# EAGLE design BlueDaq_V1.0 (EAGLE 7.6.0)
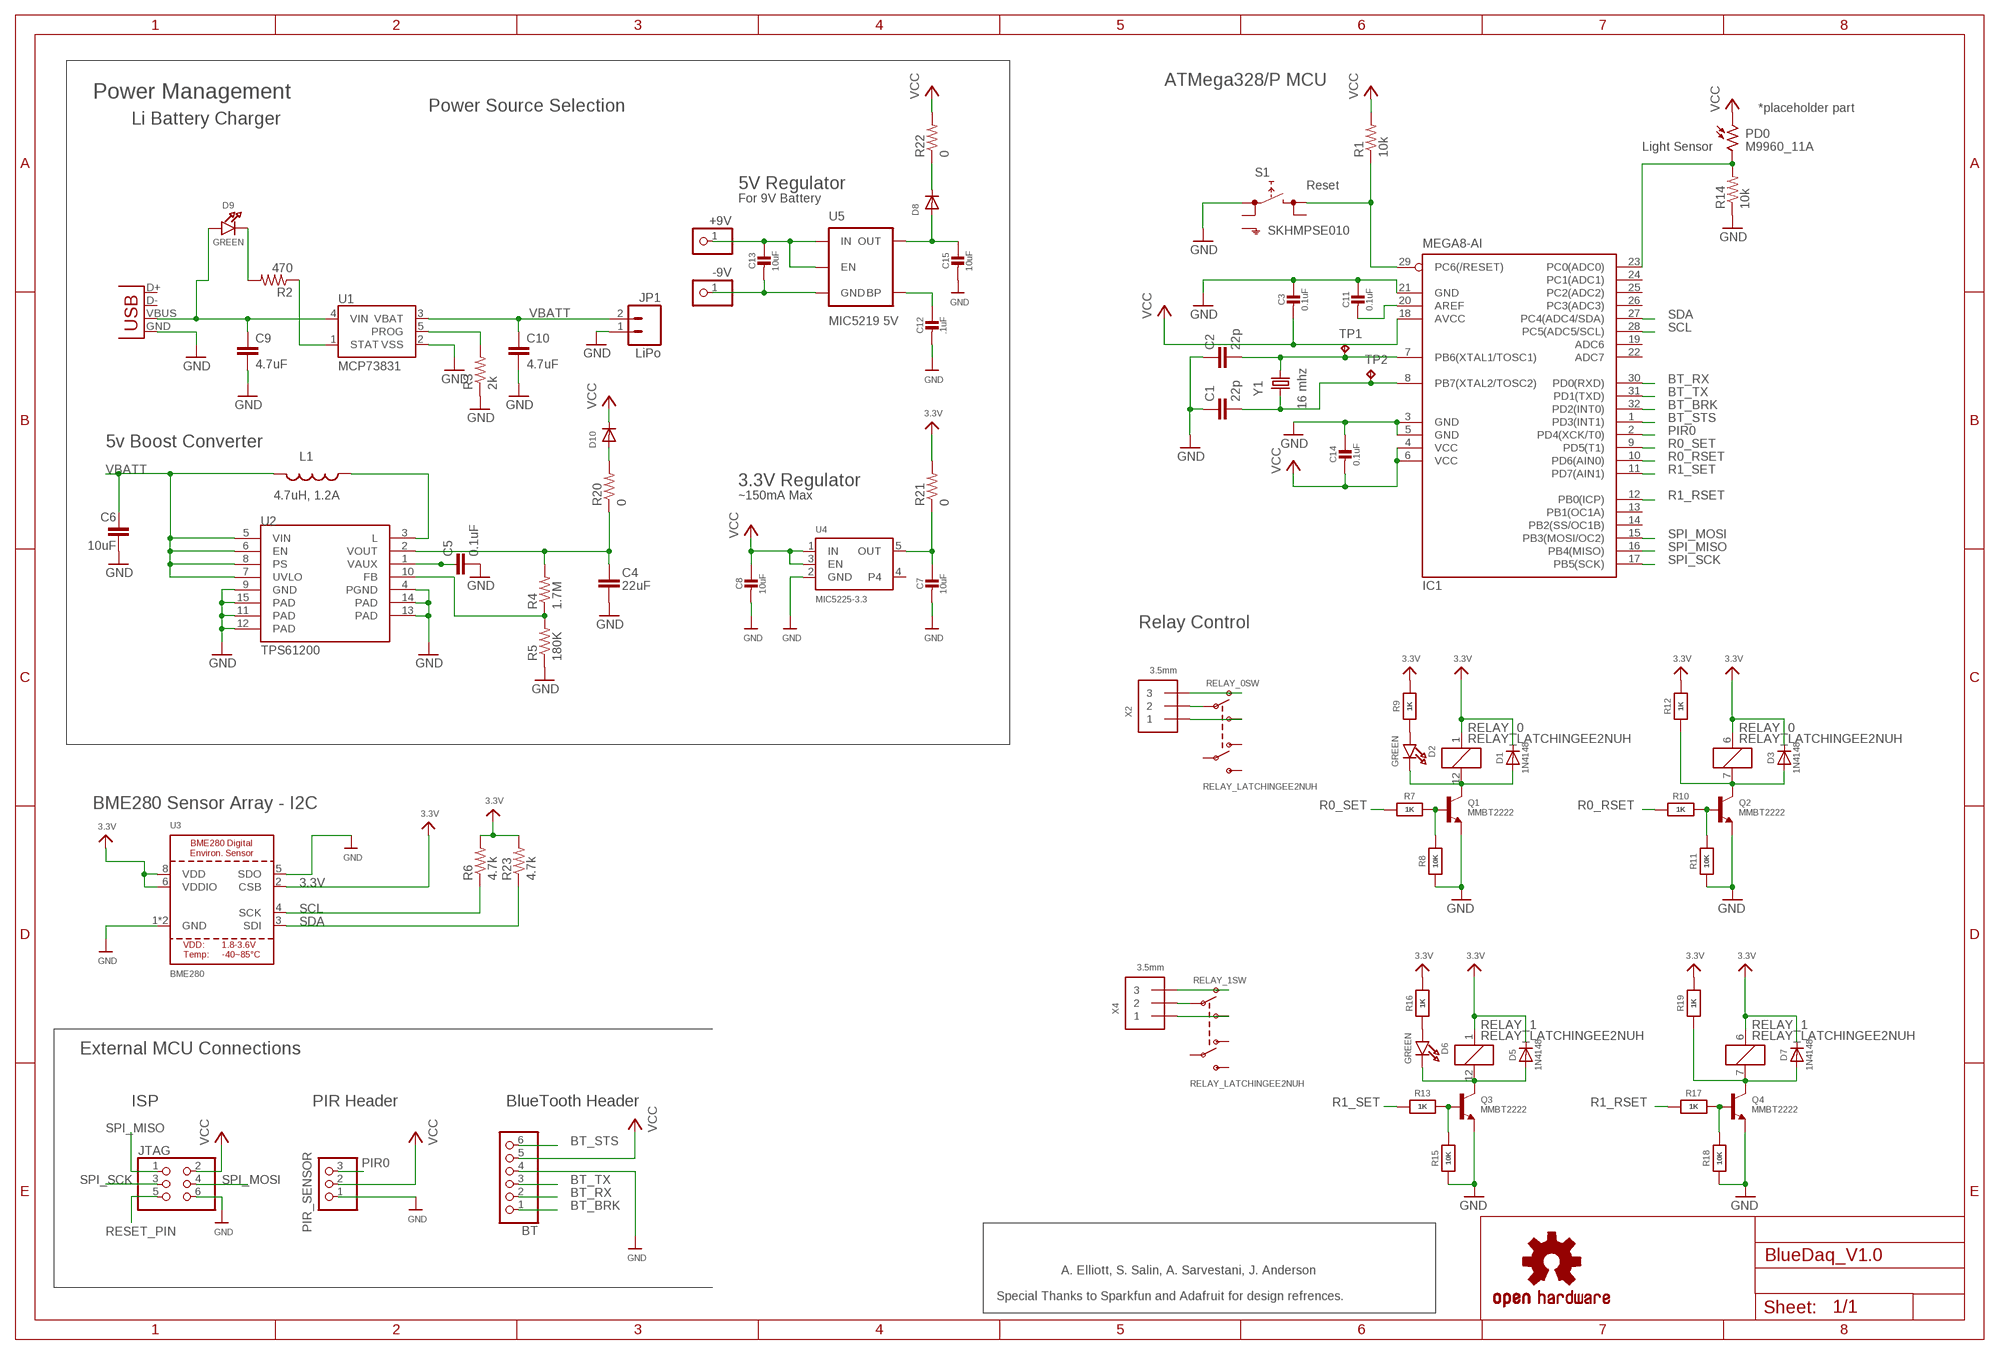
[diagram p0: schematic, sheet 1]

## Parts
+9V  PINHD-1X1  [1X01]
-9V  PINHD-1X1  [1X01]
BT  PINHD-1X6  [1X06]
C1  22p  C-EUC0805  [C0805]
C2  22p  C-EUC0805  [C0805]
C3  0.1uF  CAP_CERAMIC0805-NOOUTLINE  [0805-NO@1]
C4  22uF  CAP0805  [0805]
C5  0.1uF  CAP0805  [0805]
C6  10uF  CAP1206  [1206]
C7  10uF  CAP_CERAMIC0805-NOOUTLINE  [0805-NO@1]
C8  10uF  CAP_CERAMIC0805-NOOUTLINE  [0805-NO@1]
C9  4.7uF  CAP0805  [0805]
C10  4.7uF  CAP0805  [0805]
C11  0.1uF  CAP_CERAMIC0805-NOOUTLINE  [0805-NO@1]
C12  .1uF  CAP_CERAMIC0805-NOOUTLINE  [0805-NO@1]
C13  10uF  CAP_CERAMIC0805-NOOUTLINE  [0805-NO@1]
C14  0.1uF  CAP_CERAMIC0805-NOOUTLINE  [0805-NO@1]
C15  10uF  CAP_CERAMIC0805-NOOUTLINE  [0805-NO@1]
D1  1N4148  DIODESOD-323  [SOD-323]
D2  GREEN  LED0805_NOOUTLINE  [CHIPLED_0805_NOOUTLINE]
D3  1N4148  DIODESOD-323  [SOD-323]
D5  1N4148  DIODESOD-323  [SOD-323]
D6  GREEN  LED0805_NOOUTLINE  [CHIPLED_0805_NOOUTLINE]
D7  1N4148  DIODESOD-323  [SOD-323]
D8  DIODESMA  [SMADIODE]
D9  GREEN  LED0805_NOOUTLINE  [CHIPLED_0805_NOOUTLINE]
D10  DIODESMA  [SMADIODE]
IC1  MEGA8-AI  [TQFP32-08]
JP1  LiPo  M02-JST-2MM-SMT  [JST-2-SMD]
JTAG  PINHD-2X3  [2X03]
L1  4.7uH, 1.2A  INDUCTOR.  [CDRH2D09]
PD0  M9960_11A  [M9960]
PIR_SENSOR  PINHD-1X3  [1X03]
Q1  MMBT2222  TRANSISTOR_NPN  [SOT23-R]
Q2  MMBT2222  TRANSISTOR_NPN  [SOT23-R]
Q3  MMBT2222  TRANSISTOR_NPN  [SOT23-R]
Q4  MMBT2222  TRANSISTOR_NPN  [SOT23-R]
R1  10k  R-US_R0805  [R0805]
R2  470  R-US_R0805  [R0805]
R3  2k  R-US_R0805  [R0805]
R4  1.7M  R-US_R0805  [R0805]
R5  180K  R-US_R0805  [R0805]
R6  4.7k  R-US_R0805  [R0805]
R7  1K  RESISTOR0805_NOOUTLINE  [0805-NO]
R8  10K  RESISTOR0805_NOOUTLINE  [0805-NO]
R9  1K  RESISTOR0805_NOOUTLINE  [0805-NO]
R10  1K  RESISTOR0805_NOOUTLINE  [0805-NO]
R11  10K  RESISTOR0805_NOOUTLINE  [0805-NO]
R12  1K  RESISTOR0805_NOOUTLINE  [0805-NO]
R13  1K  RESISTOR0805_NOOUTLINE  [0805-NO]
R14  10k  R-US_R0805  [R0805]
R15  10K  RESISTOR0805_NOOUTLINE  [0805-NO]
R16  1K  RESISTOR0805_NOOUTLINE  [0805-NO]
R17  1K  RESISTOR0805_NOOUTLINE  [0805-NO]
R18  10K  RESISTOR0805_NOOUTLINE  [0805-NO]
R19  1K  RESISTOR0805_NOOUTLINE  [0805-NO]
R20  0  R-US_R0805  [R0805]
R21  0  R-US_R0805  [R0805]
R22  0  R-US_R0805  [R0805]
R23  4.7k  R-US_R0805  [R0805]
RELAY_0  RELAY_LATCHINGEE2NUH  [RELAY_EE2_LATCH]
RELAY_1  RELAY_LATCHINGEE2NUH  [RELAY_EE2_LATCH]
S1  SKHMPSE010  [SKHMPXE010]
TP1  TPTP19SQ  [TP19SQ]
TP2  TPTP19SQ  [TP19SQ]
U1  MCP73831  [SOT23-5]
U2  TPS61200  [QFN-10_PAD]
U3  BME280  [BME280]
U4  MIC5225-3.3  VREG_SOT23-5  [SOT23-5]
U5  MIC5219 5V  V_REG_MIC52195V  [SOT23-5]
U$22  OSHW-LOGOS  [OSHW-LOGO-S]
X1  USB-MICROB  [USB-MICROB]
X2  3.5mm  TERMBLOCK_1X3  [TERMBLOCK_1X3-3.5MM]
X4  3.5mm  TERMBLOCK_1X3  [TERMBLOCK_1X3-3.5MM]
Y1  16 mhz  CRYSTALHC49UV  [HC49U-V]

## Nets
3.3V: D1.C D3.C D5.C D7.C R6.2 R9.2 R12.2 R16.2 R19.2 R21.2 R23.2 RELAY_0.1 RELAY_0.6 RELAY_1.1 RELAY_1.6 U3.2(CSB) U3.6(VDDIO) U3.8(VDD)
BT_BRK: BT.1 IC1.32(PD2(INT0))
BT_RX: BT.2 IC1.30(PD0(RXD))
BT_STS: BT.6 IC1.1(PD3(INT1))
BT_TX: BT.3 IC1.31(PD1(TXD))
COM1 [HV]: RELAY_0.9(SW:P1) X2.2
COM2 [HV]: RELAY_1.9(SW:P1) X4.2
FB: R4.1 R5.2 U2.10(FB)
GND: BT.4 C1.1 C2.1 C3.1 C4.2 C5.2 C6.2 C7.2 C8.2 C9.2 C10.2 C11.1 C12.2 C14.1 C15.2 IC1.3(GND) IC1.5(GND) IC1.21(GND) JP1.1 JTAG.6 PIR_SENSOR.1 Q1.2(E) Q2.2(E) Q3.2(E) Q4.2(E) R3.1 R5.1 R8.1 R11.1 R14.1 R15.1 R18.1 S1.1(1.1) U1.2(VSS) U2.4(PGND) U2.9(GND) U2.11(PAD) U2.12(PAD) U2.13(PAD) U2.14(PAD) U2.15(PAD) U3.1(GND) U3.5(SDO) U3.7(GND) U4.2(GND) X1.GND
N$1: IC1.23(PC0(ADC0)) PD0.2 R14.2
N$2: L1.P$1 U2.3(L)
N$3: C5.1 U2.1(VAUX)
N$4: D9.C R2.2
N$5: C15.1 D8.A U5.5(OUT)
N$6: D1.A D2.C Q1.3(C) RELAY_0.12
N$7: D5.A D6.C Q3.3(C) RELAY_1.12
N$8: Q3.1(B) R13.2 R15.2
N$9: D6.A R16.1
N$10 [HV]: RELAY_1.10(SW:O1) X4.3
N$11: R3.2 U1.5(PROG)
N$12: D7.A Q4.3(C) R19.1 RELAY_1.7
N$13: Q4.1(B) R17.2 R18.2
N$14: R2.1 U1.1(STAT)
N$15: +9V.1 C13.1 U5.1(IN) U5.3(EN)
N$16: -9V.1 C13.2 U5.2(GND)
N$17: C12.1 U5.4(BP)
N$18: D8.C R22.1
N$20: D10.A R20.2
N$22: Q1.1(B) R7.2 R8.2
N$23: C9.1 D9.A U1.4(VIN) X1.VBUS
N$25: D3.A Q2.3(C) R12.1 RELAY_0.7
N$26: D2.A R9.1
N$27: Q2.1(B) R10.2 R11.2
N$28 [HV]: RELAY_0.10(SW:O1) X2.3
N$36: C11.2 IC1.20(AREF)
NO1 [HV]: RELAY_0.8(SW:S1) X2.1
NO2 [HV]: RELAY_1.8(SW:S1) X4.1
OUT: C7.1 R21.1 U4.5(OUT)
PIR0: IC1.2(PD4(XCK/T0)) PIR_SENSOR.3
R0_RSET: IC1.10(PD6(AIN0)) R10.1
R0_SET: IC1.9(PD5(T1)) R7.1
R1_RSET: IC1.12(PB0(ICP)) R17.1
R1_SET: IC1.11(PD7(AIN1)) R13.1
RESET_PIN: IC1.29(PC6(/RESET)) JTAG.5 R1.1 S1.3(2.1)
SCL: IC1.28(PC5(ADC5/SCL)) R6.1 U3.4(SCK)
SDA: IC1.27(PC4(ADC4/SDA)) R23.1 U3.3(SDI)
SPI_MISO: IC1.16(PB4(MISO)) JTAG.1
SPI_MOSI: IC1.15(PB3(MOSI/OC2)) JTAG.4
SPI_SCK: IC1.17(PB5(SCK)) JTAG.3
VBATT: C6.1 C10.1 JP1.2 L1.P$2 U1.3(VBAT) U2.5(VIN) U2.6(EN) U2.7(UVLO) U2.8(PS)
VCC: BT.5 C3.2 C8.1 C14.2 D10.C IC1.4(VCC) IC1.6(VCC) IC1.18(AVCC) JTAG.2 PD0.1 PIR_SENSOR.2 R1.2 R22.2 U4.1(IN) U4.3(EN)
VOUT: C4.1 R4.2 R20.1 U2.2(VOUT)
XTAL1: C2.2 IC1.7(PB6(XTAL1/TOSC1)) TP1.TP Y1.2
XTAL2: C1.2 IC1.8(PB7(XTAL2/TOSC2)) TP2.TP Y1.1
Unconnected: IC1.13(PB1(OC1A)) IC1.14(PB2(SS/OC1B)) IC1.19(ADC6) IC1.22(ADC7) IC1.24(PC1(ADC1)) IC1.25(PC2(ADC2)) IC1.26(PC3(ADC3)) RELAY_0.3(SW:O2) RELAY_0.4(SW:P2) RELAY_0.5(SW:S2) RELAY_1.3(SW:O2) RELAY_1.4(SW:P2) RELAY_1.5(SW:S2) S1.2(1.2) S1.4(2.2) S1.5(SH) U4.4 X1.D+ X1.D-

## Notes on the sheet
- ATMega328/P MCU
- Power Management
- Power Source Selection | *placeholder part
- Li Battery Charger
- Light Sensor
- 5V Regulator | Reset
- For 9V Battery
- 5v Boost Converter
- 3.3V Regulator
- ~150mA Max
- Relay Control
- BME280 Sensor Array - I2C
- External MCU Connections
- ISP | PIR Header | BlueTooth Header
- A. Elliott, S. Salin, A. Sarvestani, J. Anderson
- Special Thanks to Sparkfun and Adafruit for design refrences.
- Z:/Documents/School/ECE 411 & Capstone/BlueDaq Logo.bmp

## Library data of the parts
+9V -9V = adafruit:PINHD-1X1: Pin header 1x1 for 0.1" spacing With round pins
BT = adafruit:PINHD-1X6: PIN HEADER
C1 C2 = rcl:C-EU: CAPACITOR, European symbol
C3 C7 C8 C11-C15 = microbuilder:CAP_CERAMIC: Ceramic Capacitors For new designs, use the packages preceded by an '_' character since they are more reliable: The following footprints should be used on most boards: _0402 - Standard footprint for regular board layouts _0603 - Standard footprint for regular board layouts _0805 - Standard footprint for regular board layouts _1206 - Standard footprint for regular board layouts For extremely tight-pitch boards where space is at a premium, the following 'micro-pitch' footprints can be used (smaller pads, no silkscreen outline, etc.): _0402MP - Micro-pitch footprint for very dense/compact boards _0603MP - Micro-pitch footprint for very dense/compact boards _0805MP - Micro-pitch footprint for very dense/compact boards _1206MP - Micro-pitch footprint for very dense/compact boards
C4 C6 = CH_passive:CAP: Capacitor Standard 0603 ceramic capacitor, and 0.1" leaded capacitor.
C5 C9 C10 = SparkFun:CAP: Capacitor Standard 0603 ceramic capacitor, and 0.1" leaded capacitor.
D1 D3 D5 D7 = microbuilder:DIODE: Diode
D2 D6 D9 = microbuilder:LED: LED 0603 - 0603 Surface Mount Package 2mA: Green LED - Low Power (3.9mcd, 2ma, 1.7Vf) - Digikey: 475-2709-2-ND Orange LED - Low Power (9.8mcd, 2ma, 1.8Vf) - Digikey: 475-1194-2-ND Red LED - Low Power (5mcd, 2ma, 1.8Vf) - Digikey: 475-1195-2-ND Yellow LED - Low Power (7mcd, 2ma, 1.8Vf) - Digikey: 475-1196-2-ND 5mA: Blue LED - Low Power (17mcd, 5ma, 2.9Vf) - Digikey: LNJ937W8CRACT-ND 0805 - 0805 Surface Mount Package 2mA: Red LED (8.8mcd, 2mA, 1.8Vf, Clear) - Low Power [Digikey: 475-2510-1-ND] Green LED (5mcd, 2mA, 1.8Vf, Clear) - Low Power [Digikey: 475-2730-1-ND] Yellow LED (11.3mcd, 2mA, 1.8Vf, Clear) - Low Power [Digikey: 475-2555-1-ND] 20mA: Red LED (104mcd, 20mA, Diffused) - LS R976 [Digikey: 475-1278-6-ND] Red LED (12mcd, 20mA, 2.0Vf, Clear) - APT2012EC [Digikey: 754-1128-1-ND] Green LED (15mcd, 20mA, 2.2Vf, Clear) - APT2012GC [Digikey: 754-1131-1-ND] Orange LED (160mcd, 20mA, 2.1Vf, Clear) - APT2012SECK [Digikey: 754-1130-1-ND] 1206 - 1206 Surface Mount Package Green LED (26mcd, 20mA, Diffused) - LG N971 [Digikey: 475-1407-6-ND] Red LED (15mcd, 20mA, Diffused) - LH N974 [Digikey: 475-1416-6-ND] Cree - Cree High-Power Surface Mount LEDs XPEBWT-L1-0000-00D50 - White 111lm 350mA 2.9Vf 6200K 110° XTEAWT-00-0000-00000LEE3 - White 114lm 350mA 2.85Vf 5000K 115° Everlight - Everlight 45-21 Series Surface Mount LEDs 45-21/QK2C-B2832AC2CB2/2T - Warm White 2000mcd 20mA 3.25Vf 3050K 120° 45-21/LK2C-B38452C4CB2/2T - Nuetral White 2000mcd 20mA 3.25Vf 4150K 120° 45-21/LK2C-B50634C6CB2/2T - Cold White 2200mcd 20mA 3.25Vf 5650K 120° PLCC2 Reverse Mount LS T77K-J1L2-1-0-2-R18-Z - Red 11.25mcd 2mA 1.8Vf 630nm 120° LO T77K-L1M2-24-Z - Orange 19.6mcd 2mA 1.8Vf 606nm 120° LY T77K-K2M1-26-Z - Yellow 15.7mcd 2mA 1.8Vf 587nm 120°
D8 D10 = adafruit:DIODE: Diode
IC1 = atmel:MEGA8: MICROCONTROLLER 8 Kbytes FLASH, 1 kbytes SRAM, 512 bytes EEPROM, USART, 6-channel 10 bit ADC, 2-channel 8 bit ADC Pin compatible with Atmega48, ATMega88, ATMega168 Source: avr.lbr; MPN: ATMEGA8-16AU; OC_FARNELL: 9171371; OC_NEWARK: 73M8863
JP1 = SparkFun:M02: Header 2 Standard 2-pin 0.1" header. Use with straight break away headers (SKU : PRT-00116), right angle break away headers (PRT-00553), swiss pins (PRT-00743), machine pins (PRT-00117), and female headers (PRT-00115). Molex polarized connector foot print use with SKU : PRT-08233 with associated crimp pins and housings.
JTAG = pinhead:PINHD-2X3: PIN HEADER
L1 = SparkFun:INDUCTOR: Inductors Basic Inductor/Choke - 0603 and 1206. Footprints are not proven and vary greatly between part numbers.
PD0 = photo-elements:M9960_11: Photo Sensor Beacon Light, Photometer Applications Source: http://optoelectronics.perkinelmer.com/content/Datasheets/DTS_M9960.pdf
PIR_SENSOR = pinhead:PINHD-1X3: PIN HEADER
Q1-Q4 = microbuilder:TRANSISTOR_NPN: NPN Transistor Transistor (NPN) 500mA 45V - BC817 [Digikey: 568-1631-1-ND] Transistor (NPN) 500mA 45V - BC817,215 [Mouser: 771-BC817-T/R] SOT23-R - SOT23 footprint optimised for use with solder paste and reflow ovens. SOT23-W - SOT23 footprint optimised for hand-soldering (larger pads).
R1-R6 R14 R20-R23 = adafruit:R-US_: RESISTOR, American symbol
R7-R13 R15-R19 = microbuilder:RESISTOR: Resistors For new designs, use the packages preceded by an '_' character since they are more reliable: The following footprints should be used on most boards: _0402 - Standard footprint for regular board layouts _0603 - Standard footprint for regular board layouts _0805 - Standard footprint for regular board layouts _1206 - Standard footprint for regular board layouts For extremely tight-pitch boards where space is at a premium, the following 'micro-pitch' footprints can be used (smaller pads, no silkscreen outline, etc.): _0402MP - Micro-pitch footprint for very dense/compact boards _0603MP - Micro-pitch footprint for very dense/compact boards _0805MP - Micro-pitch footprint for very dense/compact boards _1206MP - Micro-pitch footprint for very dense/compact boards
RELAY_0 RELAY_1 = microbuilder:RELAY_LATCHING
S1 = switch:SKHMP*E010: 6.2 X 6.5mm TACT Switch (SMD) Source: http://www3.alps.co.jp/WebObjects/catalog.woa/PDF/E/Switch/Tact/SKHM/SKHM.PDF
TP1 TP2 = testpad:TP: Test pad
U1 = SparkFun:MCP73831: Microchip's MCP73831 Miniature single cell, fully integrated Li-Ion, Li-polymer charge management controller http://ww1.microchip.com/downloads/en/DeviceDoc/21984a.pdf
U2 = SparkFun:TPS61200: DC to DC Booster
U3 = microbuilder:BME280: BME280 - Environmental Sensor (I2C + SPI)
U4 = microbuilder:VREG_SOT23-5: SOT23-5 Fixed Voltage Regulators Part Current Out V Out V In V Dropout θJA (°C/W) TJ (°C) Digikey Part No. ADP121 150mA 3.3V 3.4-5.5V 0.09V @ 150mA -- -- ADP121-AUJZ33R7CT-ND ADP121 150mA 3.0V 3.1-5.5V 0.09V @ 150mA -- -- ADP121-AUJZ30R7CT-ND ADP122 300mA 3.3V 3.4-5.5V 0.085V @ 300mA -- -- ADP122AUJZ-3.3-R7CT-ND ADP1712 300mA 3.3V 3.5-5.5V 0.17V @ 300mA -- -- ADP1712AUJZ-3.3-R7TR-ND AP7311 (Low Cost) 150mA 3.3V 3.5-6V 0.15V @ 150mA -- -- AP7311-33WG-7DICT-ND LD39015M18R 150mA 1.8V 1.9V-5.5V 0.08V @ 100mA -- -- 497-6977-1-ND LP2985A-33DBVR 150mA 3.3V 3.3-16V 0.28V @ 150mA 206 150 296-18479-1-ND MCP1824T-3302E/OT 300mA 3.3V 3.5V-6V 0.2V @ 300mA -- -- MCP1824T-3302E/OTCT-ND MIC5205-2.5YM5 TR 150mA 2.5V 2.7-16V 0.165V @ 150mA -- -- 576-1257-2-ND MIC5205-3.0YM5 TR 150mA 3.0V 3.2V-16V 0.165V @ 150mA -- -- 576-1258-2-ND MIC5205-3.3YM5 TR 150mA 3.3V 3.5V-16V 0.165V @ 150mA -- -- 576-1259-2-ND TPS780330220 150mA 3.3V+2.2V 3.6-5.5V 250mV Max -- -- 296-23332-1-ND TDA3663/N1,135 100mA 3.3V 3.5-45V 0.18V @ 50mA -- -- 568-5343-1-ND Max operating temp can be calculated using θJA, TJ (max junction temperature), and power in watts. Set the "Maximum Ambient Temperature" until it reaches TJ ("Max Junction Temperature"), which is the absolute limit for safe use of the regulator: Heat Sink Temperature Calculator <http://www.daycounter.com/Calculators/Heat-Sink-Temperature-Calculator.phtml> For example, With 12V source into a 3.3V LP2985 and a 30mA load, we are dissipating (12V-3.3V) * 0.03A = 0.261W. With a θJA of 206 °C/W, a TJ of 150°C, and 261mW we can safely use the chip without a heat sink up to 75°C (=147.1°C Junction Temperature).
U5 = SparkFun-PowerIC:V_REG_MIC5219: V_REG MIC5219 Standard 3.3V and 5V 500mA LDO voltage regulator in SOT-23 layout. Micrel part MIC5219. BP (by-pass) pin is used to lower output noise with 470pF cap, may be left open.; PROD_ID: VREG-10107
U$22 = SparkFun:OSHW-LOGO: Open Source Hardware Logo This logo indicates the piece of hardware it is found on incorporates a OSHW license and/or adheres to the definition of open source hardware found here: http://freedomdefined.org/OSHW
X1 = SparkFun:USB: USB Connectors USB-B-PTH is fully proven SKU : PRT-00139 USB-miniB is fully proven SKU : PRT-00587 USB-A-PCB is untested. USB-A-H is throughly reviewed, but untested. Spark Fun Electronics SKU : PRT-00437 USB-B-SMT is throughly reviewed, but untested. Needs silkscreen touching up. USB-A-S has not been used/tested USB-MB-H has not been used/tested
X2 X4 = microbuilder:TERMBLOCK_1X3: 3.5mm Terminal block http://www.ladyada.net/library/pcb/eaglelibrary.html
Y1 = SparkFun-FreqCtrl:CRYSTAL: Various standard crystals. Proven footprints.

## Net classes
1 HV: width 0.406 mm, drill 0.381 mm, clearance 1.016 mm

## Board
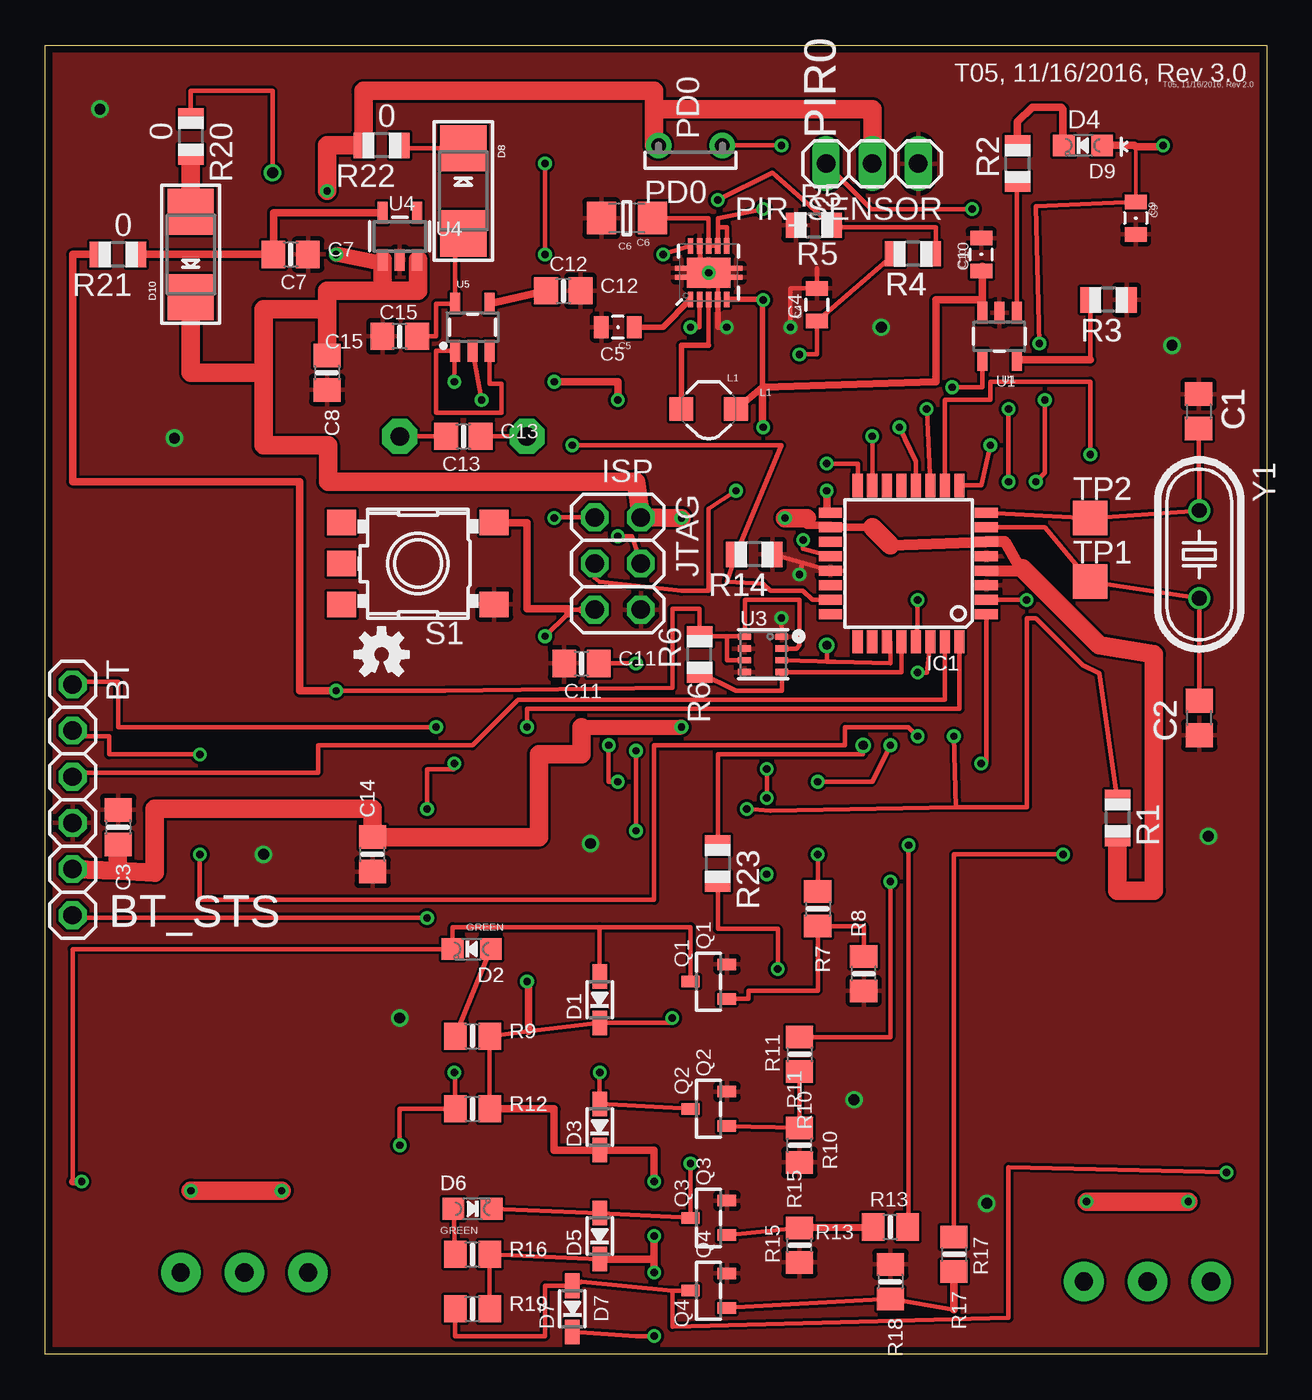
[diagram p1: board, top side]
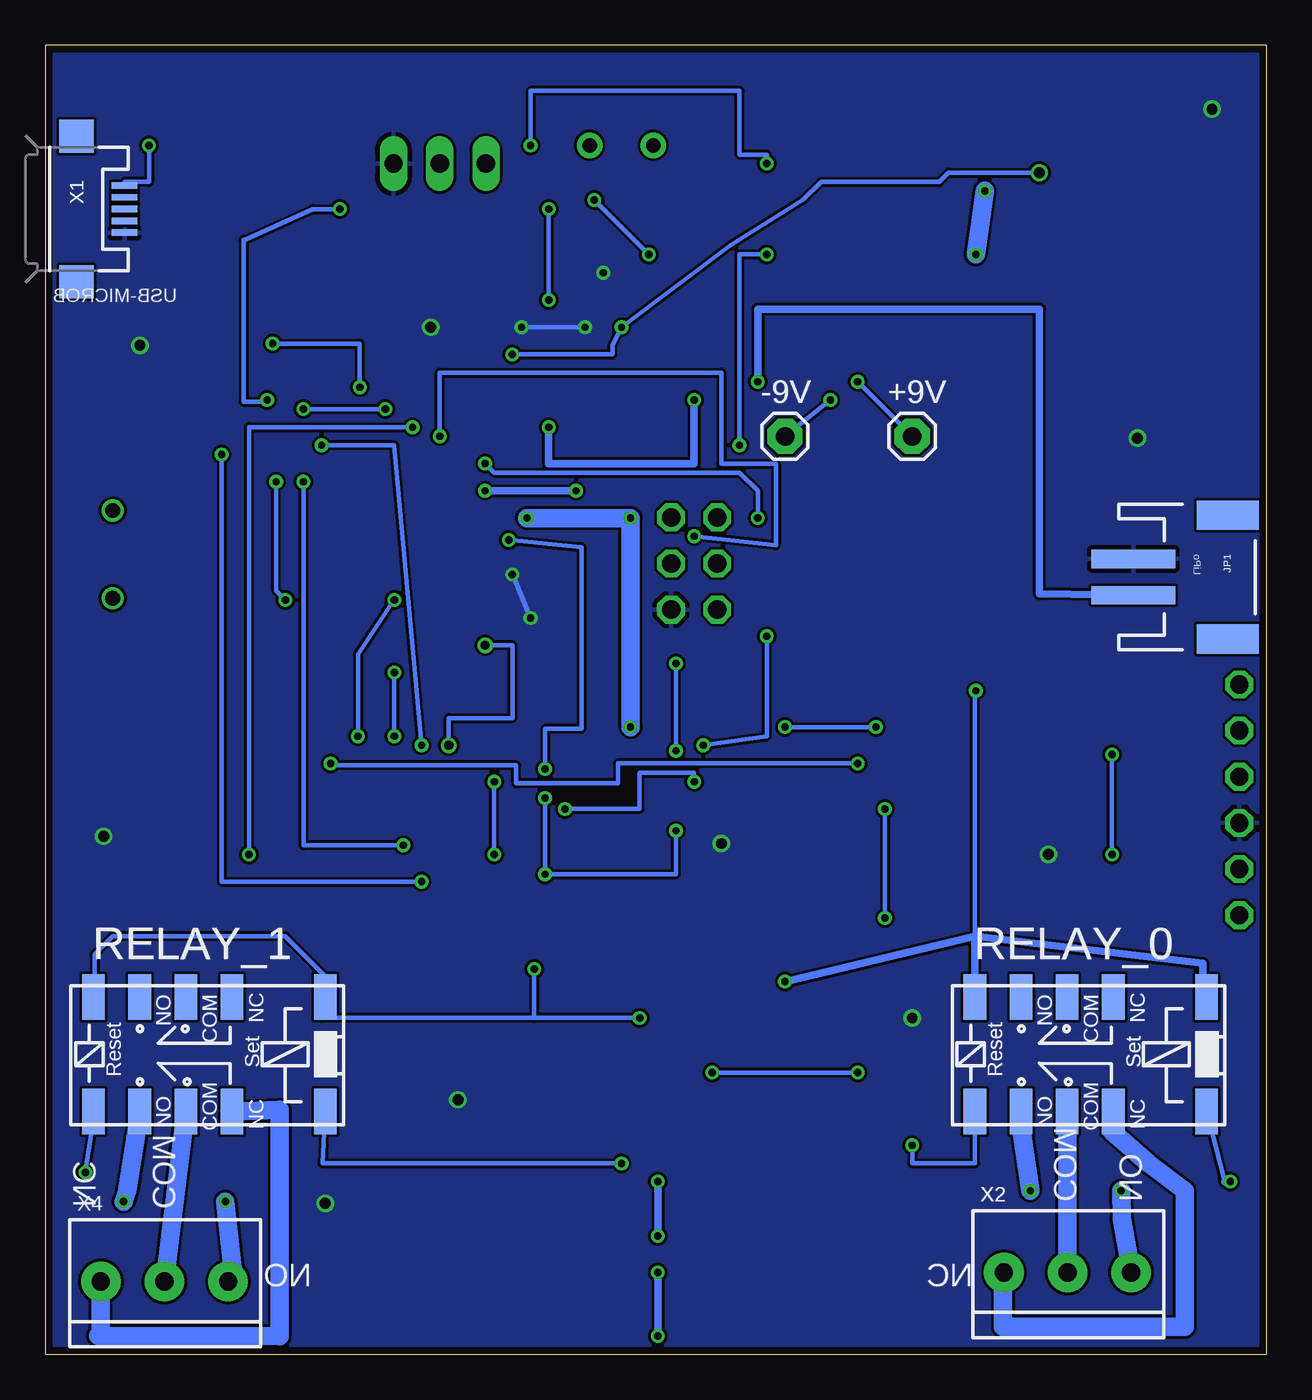
[diagram p2: board, bottom side, seen from below]

Size 67.2 x 72 mm. Coordinates in mm from the lower left corner, seen from the top.
Outline: 0,0 0,72 67.2,72 67.2,0 0,0
Copper layers (1*16): Top 0.0356mm / dielectric 1.5011mm / Bottom 0.0356mm
Design rules "OSH-Park-2-layer": minimum track width 6mil, minimum drill 13mil, track to track 6mil, track to pad 6mil, pad to pad 6mil, via to via 6mil, smd to smd 6mil, copper to edge 15mil, drill to drill 6mil, minimum pad ring 7mil, minimum via ring 7mil, stop-mask expansion 3mil, vias tented up to drill 0mil, thermal gap 10mil

### Footprints (pad centres in the part's own frame; a part is rotated, then mirrored left to right if it is on the bottom)
1X01 = drill 1.016 pad 1.93 octagon: 1 0,0
1X06 = drill 1.016 octagon: 1 -6.35,0; 2 -3.81,0; 3 -1.27,0; 4 1.27,0; 5 3.81,0; 6 6.35,0
C0805 = smd 1.3 x 1.5: 1 -0.95,0; 2 0.95,0
0805-NO@1 = smd 1.3 x 1.5: 1 -0.95,0; 2 0.95,0
0805 = smd 0.8 x 1.2: 1 -0.9,0; 2 0.9,0
1206 = smd 1.6 x 1.8: 1 -1.4,0; 2 1.4,0
SOD-323 = smd 1.35 x 0.8: A 1.27,0; C -1.27,0
CHIPLED_0805_NOOUTLINE = smd 1.2 x 1.2: A 0,-1.05; C 0,1.05
SMADIODE = smd 2.54 x 2.54: A 2.349,0; C -2.349,0
TQFP32-08 = smd 1.27 x 0.559: 1 -4.293,2.8; 2 -4.293,2; 3 -4.293,1.2; 4 -4.293,0.4; 5 -4.293,-0.4; 6 -4.293,-1.2; 7 -4.293,-2; 8 -4.293,-2.8; 17 4.293,-2.8; 18 4.293,-2; 19 4.293,-1.2; 20 4.293,-0.4; 21 4.293,0.4; 22 4.293,1.2; 23 4.293,2; 24 4.293,2.8 | smd 0.559 x 1.27: 9 -2.8,-4.293; 10 -2,-4.293; 11 -1.2,-4.293; 12 -0.4,-4.293; 13 0.4,-4.293; 14 1.2,-4.293; 15 2,-4.293; 16 2.8,-4.293; 25 2.8,4.293; 26 2,4.293; 27 1.2,4.293; 28 0.4,4.293; 29 -0.4,4.293; 30 -1.2,4.293; 31 -2,4.293; 32 -2.8,4.293
JST-2-SMD = smd 1 x 4.6: 1 -1,-3.7; 2 1,-3.7 | smd 1.6 x 3.4: NC1 -3.4,1.5; NC2 3.4,1.5
2X03 = drill 1.016 octagon: 1 -2.54,-1.27; 2 -2.54,1.27; 3 0,-1.27; 4 0,1.27; 5 2.54,-1.27; 6 2.54,1.27
CDRH2D09 = smd 1.3 x 1.3: P$1 -1.5,0; P$2 1.5,0
M9960 = drill 0.8 pad 1.4: 1 -1.75,0; 2 1.75,0
1X03 = drill 1.016 long: 1 -2.54,0; 2 0,0; 3 2.54,0
SOT23-R = smd 0.635 x 1.016: 1 -0.95,-1; 2 0.95,-1; 3 0,1
R0805 = smd 1.1 x 1.4: 1 -1,0; 2 1,0
0805-NO = smd 1.24 x 1.5: 1 -0.95,0; 2 0.95,0
RELAY_EE2_LATCH = smd 1.25 x 2.5: 1 -6.2,-3.15; 3 -1.07,-3.15; 4 1.47,-3.15; 5 4.01,-3.15; 6 6.55,-3.15; 7 6.55,3.15; 8 4.01,3.15; 9 1.47,3.15; 10 -1.07,3.15; 12 -6.2,3.15
SKHMPXE010 = smd 1.6 x 1.4: 1 -4.2,2.25; 2 4.2,2.25; 3 -4.2,-2.25; 4 4.2,-2.25; 5 4.2,0
TP19SQ = smd 1.9 x 1.9: TP 0,0
SOT23-5 = smd 0.55 x 1.2: 1 -0.95,-1.3; 2 0,-1.3; 3 0.95,-1.3; 4 0.95,1.3; 5 -0.95,1.3
QFN-10_PAD = smd 0.297 x 0.85: 1 -1,-1.475; 2 -0.5,-1.475; 3 0,-1.475; 4 0.5,-1.475; 5 1,-1.475; 6 1,1.475; 7 0.5,1.475; 8 0,1.475; 9 -0.5,1.475; 10 -1,1.475 | smd 0.7 x 0.28: 11 -1.5,0.25; 12 -1.5,-0.25; 13 1.5,0.25; 14 1.5,-0.25 | smd 2.4 x 1.65: 15 0,0
BME280 = smd 0.7 x 0.35: 1 1.025,0.975; 2 1.025,0.325; 3 1.025,-0.325; 4 1.025,-0.975; 5 -1.025,-0.975; 6 -1.025,-0.325; 7 -1.025,0.325; 8 -1.025,0.975
USB-MICROB = smd 0.35 x 1.4: D+ 0,2.65; D- -0.65,2.65; GND 1.3,2.65; ID 0.65,2.65; VBUS -1.3,2.65 | smd 1.8 x 1.9: MT1 -4,0; MT2 4,0
TERMBLOCK_1X3-3.5MM = drill 1 pad 2.184: 1 3.55,0; 2 0.05,0; 3 -3.45,0
HC49U-V = drill 0.813: 1 -2.413,0; 2 2.413,0

### Placement (x,y rotation side)
+9V  19.5,50.5 0 bottom
-9V  26.5,50.5 0 bottom
BT  1.5,30.5 270 top
C1  63.46,51.87 270 top
C2  63.5,35 90 top
C3  4,29 270 top
C4  42.46,57.73 90 top
C5  31.5,56.5 180 top
C6  32,62.5 180 top
C7  13.5,60.5 0 top
C8  15.5,54 270 top
C9  60,62.5 270 top
C10  51.5,60.5 90 top
C11  29.5,38 0 top
C12  28.5,58.5 0 top
C13  23,50.5 0 top
C14  18,27.5 90 top
C15  19.5,56 180 top
D1  30.5,19.5 90 top
D2  23.46,22.29 90 top
D3  30.5,12.5 90 top
D5  30.5,6.5 90 top
D6  23.5,8 270 top
D7  29,2.5 90 top
D8  23,64 270 top
D9  57.1,66.5 90 top
D10  8,60.5 90 top
IC1  47.5,43.5 180 top
JP1  3.63,42.75 270 bottom
JTAG  31.5,43.5 270 top
L1  36.5,52 0 top
PD0  35.5,66.5 0 top
PIR_SENSOR  45.5,65.5 180 top
Q1  36.5,20.5 90 top
Q2  36.5,13.5 90 top
Q3  36.5,7.5 90 top
Q4  36.5,3.5 90 top
R1  59,29.5 270 top
R2  53.5,65.5 90 top
R3  58.5,58 180 top
R4  47.74,60.54 180 top
R5  42.29,62.11 0 top
R6  36,38.5 90 top
R7  42.5,24.5 270 top
R8  45.03,20.94 90 top
R9  23.5,17.5 0 top
R10  41.5,16.5 270 top
R11  41.5,11.5 90 top
R12  23.5,13.5 0 top
R13  46.5,7 180 top
R14  39,44 180 top
R15  41.5,6 90 top
R16  23.5,5.5 0 top
R17  50,5.5 270 top
R18  46.5,4 270 top
R19  23.5,2.5 0 top
R20  8,67 270 top
R21  4,60.5 180 top
R22  18.5,66.5 180 top
R23  37,27 270 top
RELAY_0  9.5,16.5 180 bottom
RELAY_1  58,16.5 180 bottom
S1  20.5,43.5 180 top
TP1  57.5,42.5 0 top
TP2  57.5,46 0 top
U1  52.5,56 180 top
U2  36.5,59.5 0 top
U3  39.5,38.5 0 top
U4  19.5,61.5 0 top
U5  23.5,56.5 0 top
U$22  18.5,38.5 0 top
X1  65.5,63 270 bottom
X2  11,4.5 0 bottom
X4  60.7,4 0 bottom
Y1  63.5,44 270 top

### Tracks (layer width: path | path; a pad name or v marks a point on that pad's centre or on a via)
3.3V  (via drill 0.4)
  Top 0.254: R12.2 R9.2 26.59,17.76 D1.C 34.5,18.23 v34.5,18.5 | D5.C R16.2 R19.2 | v33.5,1 32.5,1 D7.C | v16,36.5 22,36.5 34.5,36.67 34.5,41 36,41 R6.2 37.5,39.5 | 37.5,39.5 38.45,39.5 U3.8 38.5,39.48 38.5,41.5 41.5,41.5 41.5,39 41.33,38.83 U3.2 | U3.6 37.5,38.17 37.5,39.5 | R23.2 37,23.4 40.3,23.4 v40.3,21.2
  Top 0.406: D5.C 33.5,5.23 v33.5,4.5 v33.5,6.5 | v33.5,9.5 33.5,11.23 D3.C 28,11.23 28,13.5 R12.2 | R21.2 1.5,60.5 1.5,48 14,48 14,36.5 v16,36.5 | v26.5,20.5 26.59,20.5 26.59,17.76
  Bottom 0.254: 16.05,23 16.05,36.5 v16,36.5 | v34.5,18.5 40.3,18.5 | 40.3,18.5 52,18.5 52,19.5 51.8,19.5 RELAY_1.1 51.8,20.8 54,23 63.5,23 64.5,22 64.5,19.7 RELAY_1.6 | 3.5,19.85 RELAY_0.1 | v40.3,21.2 40.3,18.5
  Bottom 0.406: RELAY_0.6 16.05,23 | 16.05,23 3.5,21.5 3.5,19.85 | v26.5,20.5 16.05,23 | v33.5,4.5 v33.5,1 | v33.5,9.5 v33.5,6.5
BT_BRK  (via drill 0.4)
  Top 0.254: IC1.32 50.3,35.5 26.5,35.5 v26.5,34.5 | v21.5,34.5 4,34.5 4,37 1.5,37 BT.1
  Bottom 0.254: v26.5,34.5 v21.5,34.5
BT_RX  (via drill 0.4)
  Top 0.254: IC1.30 48.5,37.5 v48,37.5 | v8.5,27.5 8.5,25 33.5,25 33.5,33.5 44,33.5 44,34.5 47.5,34.5 v48,34 | v8.5,33 3.5,33 3.5,34 1.5,34 BT.2
  Bottom 0.254: v48,37.5 v48,34 | v8.5,27.5 v8.5,33
BT_STS  (via drill 0.4)
  Top 0.254: IC1.1 51.79,32.5 v51.5,32.5 | v22.5,32.5 22.5,32.18 21,32.18 v21,30 | v21,24 1.5,24
  Top 0.406: 1.5,24 BT.6
  Bottom 0.254: v21,30 v21,24 | v22.5,32.5 35.7,32.5 35.7,31.4 41.3,31.4 41.3,32.4 51.5,32.4 v51.5,32.5
BT_TX
  Top 0.254: IC1.31 49.5,36 26,36 23.5,33.5 15,33.5 15,32 1.5,32 BT.3
COM1
  Bottom 1.016: X2.2 RELAY_0.9
COM2
  Bottom 1.016: X4.2 RELAY_1.9
FB  (via drill 0.4)
  Top 0.254: R4.1 49,60.5 49,62 43.29,62 R5.2 40,65 v37,63.5 | v34,60.5 U2.10
  Bottom 0.254: v37,63.5 v34,60.5
GND  (via drill 0.4, 0.6, 0.6 pad 0.25)
  Top 0.203: U2.4 37,59.5
  Top 0.254: 42.46,59.75 C4.2 41,58.63 v41,56.5 | 40,43.6 R14.1 41.65,43.54 | U3.1 v40.5,40.5 | IC1.21 41.65,43.54 | v41.5,42.9 41.65,43.54 | 37,59.5 37,59.75 U2.13 | 36.5,59.75 U2.15 36.1,59.7 | 36.1,59.7 U2.9 | 36.1,59.7 35.3,59.7 U2.11
  Top 0.305: U2.4 37,56.5 v37.5,56.5
  Bottom 0.254: v37.5,56.5 v41,56.5 | v40.5,40.5 v41.5,42.9
  other vias: 3,68.5 7.1,50.4 62,55.5 46,56.5 64,28.5 30,28.1 12,27.5 19.5,18.5 51.8,8.3 44.5,14 36.5,59.5
  pour Top: 0,0 0,72 67.2,72 67.2,0
  pour Bottom: 0,0 0,72 67.2,72 67.2,0
N$1  (via drill 0.4)
  Top 0.254: v29,50 40.5,50 R14.2 37.5,42.5 39.5,42.4 39.9,42 41.7,42 42.2,41.5 IC1.23 | v40.5,66.5 PD0.2 | v27.5,60.5 v27.5,65.5
  Bottom 0.254: v40.5,66.5 40.5,69.5 29,69.5 29,66 27.5,66 v27.5,65.5 | v29,50 29,60.5 v27.5,60.5
N$2
  Top 0.254: U2.3 36.5,55.5
  Top 0.305: 36.5,55.5 35,55.5 L1.P$1
N$3
  Top 0.305: C5.1 34,56.5 U2.1
N$4
  Top 0.406: R2.2 53.5,67.8 54.3,68.6 55.9,68.6 56,68.5 56,66.55 D9.C
N$5
  Top 0.254: D8.A 22.55,61.65 U5.5 21.5,57.8 21.5,56 C15.1
N$6  (via drill 0.4)
  Top 0.254: 30.5,23.5 22.41,23.5 D2.C 1.5,22.29 1.5,9.5 | 30.5,23.5 D1.A | 30.5,23.5 35.5,23.5 Q1.3
  Top 0.406: 1.5,9.5 v2,9.5
  Bottom 0.254: 2.3,9.5 RELAY_0.12
  Bottom 0.406: v2,9.5 2.3,9.5
N$7  (via drill 0.4)
  Top 0.254: D6.C D5.A 34.98,7.53 Q3.3 v35.5,10.5
  Bottom 0.254: RELAY_1.12 51.95,10.5 v35.5,10.5
N$8
  Top 0.254: Q3.1 R15.2
  Top 0.406: R15.2 R13.2
N$9
  Top 0.254: D6.A R16.1
N$10
  Bottom 0.406: 64.3,1.03 64.3,1.2 64.15,1.2
  Bottom 1.016: RELAY_1.10 54.3,13.45 54.3,1 64.3,1.03 | 64.15,1.2 X4.3
N$11
  Top 0.254: R3.2 57.5,54.7
  Top 0.406: 57.5,54.7 U1.5
N$12  (via drill 0.4)
  Top 0.254: R19.1 22.55,1 27.5,1 27.5,3.77 D7.A 29.5,4 34.5,3.5 | 34.5,3.5 Q4.3 | v65,10 53,10.3 53,2 34.5,1.5 34.5,3.5
  Bottom 0.254: RELAY_1.7 64.5,13.35 v65,10
N$13
  Top 0.254: Q4.1 R18.2 50,2.45
  Top 0.406: 50,2.45 R17.2
N$14
  Top 0.254: R2.1 53.45,64.5 U1.1
N$15  (via drill 0.4)
  Top 0.254: v22.5,53.5 U5.1 21.5,55.2 21.5,51.8 25.1,51.8 25.1,53.4 24.45,53.4 U5.3 | +9V.1 C13.1
  Bottom 0.254: +9V.1 v22.5,53.5
N$16  (via drill 0.4)
  Top 0.254: v24,52.5 U5.2 | C13.2 -9V.1
  Bottom 0.254: -9V.1 v24,52.5
N$17
  Top 0.406: U5.4 C12.1
N$18
  Top 0.254: D8.C 19.5,66.35 R22.1
N$20
  Top 1.016: D10.A R20.2
N$22
  Top 0.254: R8.2 45.03,23.55 R7.2 42.5,20 38.7,20 38.7,19.55 Q1.1
N$23  (via drill 0.4)
  Top 0.203: 60,66.43 C9.1
  Top 0.254: C9.1 54.5,63.15 v54.7,55.6 | v49.9,53.2 51.55,53.2 U1.4
  Top 0.406: D9.A 59.93,66.5 60,66.43 61.43,66.43 v61.5,66.5
  Bottom 0.254: v61.5,66.5 61.5,64.5 62.85,64.5 X1.VBUS | v54.7,55.6 49.9,55.6 v49.9,53.2
N$25  (via drill 0.4)
  Top 0.254: v19.5,11.5 19.5,13.5 R12.1 22.55,15.5 v22.5,15.5 | Q2.3 D3.A v30.5,15.5
  Bottom 0.254: v19.5,11.5 19.5,10.5 16.05,10.5 RELAY_0.7 | v22.5,15.5 v30.5,15.5
N$26
  Top 0.254: D2.A R9.1
N$27
  Top 0.254: Q2.1 R11.2 R10.2
N$28
  Bottom 1.016: X2.3 14.5,3.5 14.5,1.5 4.5,1.5 4.5,9 6.5,10.5 8.5,12.28 RELAY_0.10
N$36  (via drill 0.4)
  Top 0.254: IC1.20 41.7,44.3 v41.7,44.8 | v32.5,28.8 v32.5,33.2 | v32.5,38 C11.2 | v39.7,32.2 v39.7,30.6
  Bottom 0.254: v41.7,44.8 37.7,44.4 37.7,34.4 39.7,34.4 v39.7,32.2 | v32.5,28.8 32.5,26.4 v39.7,26.4 v39.7,30.6 | v32.5,33.2 v32.5,38
NO1  (via drill 0.4)
  Top 1.016: v8,9 v13,9
  Bottom 1.016: RELAY_0.8 13.5,12.34 v13,9 | X2.1 7.95,7.45 v8,9
NO2  (via drill 0.4)
  Top 1.016: v62.9,8.4 v57.3,8.4
  Bottom 0.406: 56.8,4 X4.1
  Bottom 1.016: RELAY_1.8 62.71,9 v62.9,8.4 | v57.3,8.4 56.8,4
OUT
  Top 0.406: R21.1 C7.1 12.55,62.8 U4.5
PIR0  (via drill 0.4)
  Top 0.254: IC1.2 v54,41.5 | v54.5,48 55,48.5 v55,52.5 | v51,63 45.46,63 PIR_SENSOR.3
  Bottom 0.254: v54,41.5 54.5,42 v54.5,48 | v51,63 52.5,63 56.2,61.3 56.3,61.3 56.3,52.4 55,52.4 v55,52.5
R0_RSET  (via drill 0.4)
  Top 0.254: IC1.10 49.5,52.5 52,52.5 52,53.5 57.5,53.5 v57.5,49.5 | v46.5,26 46.5,17.45 R10.1
  Bottom 0.254: v57.5,49.5 57.5,26 v46.5,26
R0_SET  (via drill 0.4)
  Top 0.254: R7.1 v42.5,27.5 | v42.5,31.5 45.5,31.5 v46.5,33.5 | v52,50 51.5,47.79 IC1.9
  Bottom 0.254: v42.5,27.5 v42.5,31.5 | v46.5,33.5 48,50 v52,50
R1_RSET  (via drill 0.4)
  Top 0.254: v47,51 47.9,49.1 IC1.12 | v56,27.5 50,27.5 R17.1
  Bottom 0.254: v56,27.5 56,51 v47,51
R1_SET  (via drill 0.4)
  Top 0.254: v48.5,52 IC1.11 | v53,48 v53,52 | R13.1 47.5,6.5 v47.5,28
  Bottom 0.254: v47.5,28 53,28 v53,48 | v48.5,52 v53,52
RESET_PIN  (via drill 0.4)
  Top 0.254: R1.1 58,37.46 57.09,37.91 54.5,40.5 54,40.5 54,30.1 50.1,30.1 | 50.1,30.1 39.9,29.9 v38.6,30 | v31.5,31.5 31,31.5 v31,33.5 | v27.5,39.5 28.75,40.75 28.96,40.96 JTAG.5 | IC1.29 48,40.11 v48,41.5 | v50,34 50.1,30.1
  Top 0.406: JTAG.5 29.49,40.96 | S1.3 26.5,45.75 26.5,41 28.75,41 28.75,40.75
  Bottom 0.254: v38.6,30 34.5,30 34.5,32 31.5,32 v31.5,31.5 | v31,33.5 27.5,34 v27.5,39.5 | v48,41.5 50,38.5 v50,34
SCL
  Top 0.254: IC1.28 47.1,37.52 U3.4 40.52,36.5 38,36.5 R6.1
SDA  (via drill 0.5)
  Top 0.254: IC1.27 46.5,39.21 46.5,38 43.49,38.09 | 43.49,38.09 U3.3 | R23.1 37,33 45,33 v45,33.5 | v43,39 43,38.09 43.49,38.09
  Bottom 0.254: v45,33.5 45,35 41.5,35 41.5,39 v43,39
SPI_MISO  (via drill 0.4)
  Top 0.254: IC1.16 44.7,49 v43,49 | v28,46 28.04,46.04 JTAG.1
  Bottom 0.254: v43,49 42.5,48.5 29,48.5 28,47.5 v28,46
SPI_MOSI  (via drill 0.4)
  Top 0.254: IC1.15 v45.5,50.5 | v31.5,45 32.27,45 JTAG.4
  Bottom 0.254: v45.5,50.5 45.5,54 30,54 30,49 27,49 27,44.5 v31.5,45
SPI_SCK  (via drill 0.4)
  Top 0.254: v38,47.5 36.5,46.5 36.5,42 35,42 30.5,42.5 30.23,42.73 JTAG.3
  Top 0.406: IC1.17 43,46.51 v43,47.5
  Bottom 0.406: v43,47.5 v38,47.5
VBATT  (via drill 0.4)
  Top 0.254: 51.55,59.85 C10.1 | U2.5 37.5,58 | C6.1 36.5,62.5 U2.8 U2.7 37,62 | 37,62 37,62.5 v39.5,63 | v39.5,58 39.5,58.02 38.5,58.02 | U2.6 37.5,62 37,62
  Top 0.305: U2.5 38.5,58.02 39.47,58.02 39.47,52.5
  Top 0.406: U1.3 51.55,58 | 51.55,58 51.55,59.85 | L1.P$2 39.47,53.2 | 39.47,53.2 49,53.5 49,58 51.55,58 | v28,53.5 31.5,53.5 v31.5,52.5 | v39.5,51 39.47,51 39.47,52.5 39.47,53.2
  Bottom 0.254: v39.5,63 v39.5,58
  Bottom 0.406: JP1.2 12.5,41.83 12.5,57.5 28,57.5 v28,53.5 | v31.5,52.5 31.5,49 39.5,49 v39.5,51
VCC  (via drill 0.4)
  Top 0.254: 33.5,66.5 PD0.1 | 53.75,43.1 53.75,43.25 | 41.9,46 41.9,45.6 | 43.21,45.6 IC1.18
  Top 0.406: 20.5,60.2 U4.3 | U4.1 18.55,60 | 45.5,45.5 IC1.18 | 43.21,45.6 41.9,45.6
  Top 0.61: 53.75,43.25 53.5,43.5 52.8,44.7 IC1.6 46.5,44.5 | IC1.4 53.75,43.1
  Top 0.813: 29.5,34.5 v35,34.5 | 18.55,60 v16,60.5
  Top 1.016: PIR_SENSOR.2 45.5,68.5 33.5,68.5 | 33.5,68.5 33.5,66.5 | 53.75,43.25 58,39 61,38.5 61,25.5 59,25.5 R1.2 | 29.5,34.5 29.5,33 27.16,33 27.16,28.45 C14.2 18,30 6,30 6,26.5 3.98,26.59 | U4.1 18.55,58.5 | 18.55,58.5 20.5,58.5 20.5,60.2 | v15.5,64 15.5,66.5 R22.2 17.5,69.5 33.5,69.5 33.5,68.5 | v35,46 JTAG.2 32.5,48 15.55,48 15.55,50 12,50 12,54 | 45.5,45.5 46.5,44.5 | 3.98,26.59 BT.5 | C8.1 15.5,57.5 | 15.5,57.5 15.5,58.5 18.55,58.5 | 12,54 12,57.5 15.5,57.5 | C3.2 3.98,28.05 3.98,26.59 | D10.C 8,54 12,54 | v40.7,46 41.9,46
  Bottom 1.016: v16,60.5 v15.5,64 | v35,34.5 v35,46 v40.7,46
VOUT  (via drill 0.4, 0.6)
  Top 0.254: R4.2 C4.1 42.46,55 v41.5,55 | U2.2 36,56.5 v35.5,56.5 | v12.5,65 12.5,69.5 8,69.5 R20.1
  Bottom 0.254: v41.5,55 36,55 36,55.5 v35.5,56.5 29.5,61 25.5,63.5 24.5,64.5 18,64.5 17.5,65 v12.5,65
XTAL1
  Top 0.254: C2.2 Y1.2 TP1.TP 55,45.5 IC1.7
XTAL2
  Top 0.254: C1.2 Y1.1 TP2.TP IC1.8

### Text on the board
tNames: T05, 11/16/2016, Rev 2.0 | PIR0 | BT_STS
_tsilk: T05, 11/16/2016, Rev 3.0 | 0 | 0 | D4 | D8 | PD0 | PIR0 | R2 | 0 | U4 | C9 | C6 | C12 | R5 | R4 | C10 | C7 | U5 | D10 | C15 | C4 | R3 | C5 | U1 | L1 | C1 | C8 | C13 | ISP | TP2 | TPTP19SQ | R14 | TP1 | TPTP19SQ | U3 | BT | IC1 | C11 | R6 | C2 | C14 | R1 | R23 | C3 | BT_STS | GREEN | R8 | R7 | D2 | Q1 | D1 | R9 | R11 | Q2 | R12 | R10 | D3 | D6 | R13 | Q3 | GREEN | R17 | R16 | D5 | R15 | R19 | D7 | R18 | Q4
_bsilk: X1 | USB-MICROB | +9V | -9V | JP1 | LiPo | RELAY_0 | RELAY_1 | NC | COM | NO | NC | COM | NO | Set | Reset | Set | Reset | COM | COM | NC | NO | NC | NO | NO | COM | X2 | COM | NC | NC | NO